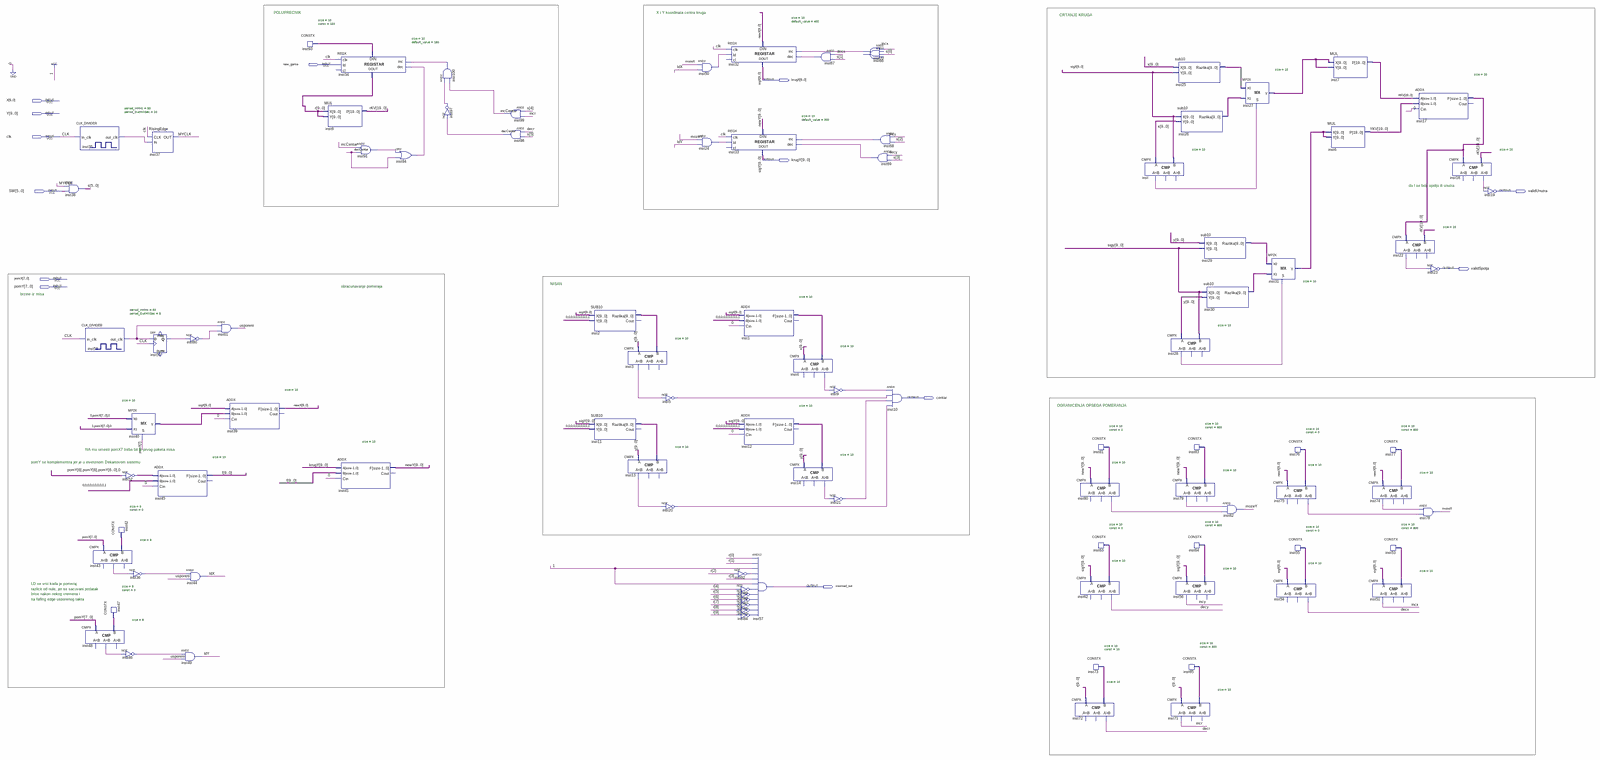
[diagram p0: schematic sheet, whole]
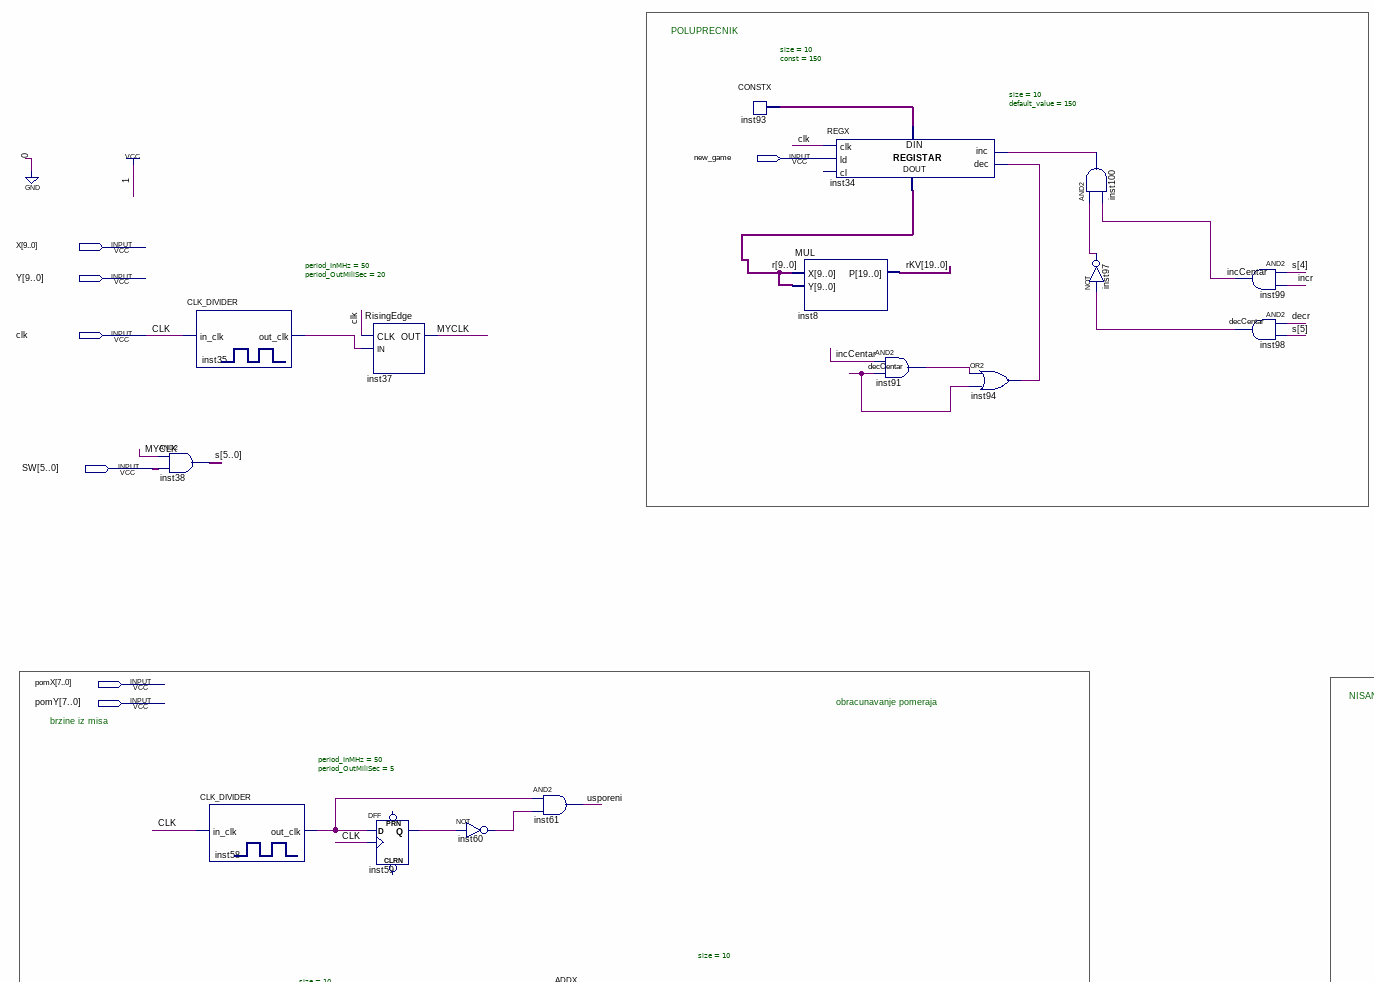
[diagram p1: schematic sheet, upper left part]
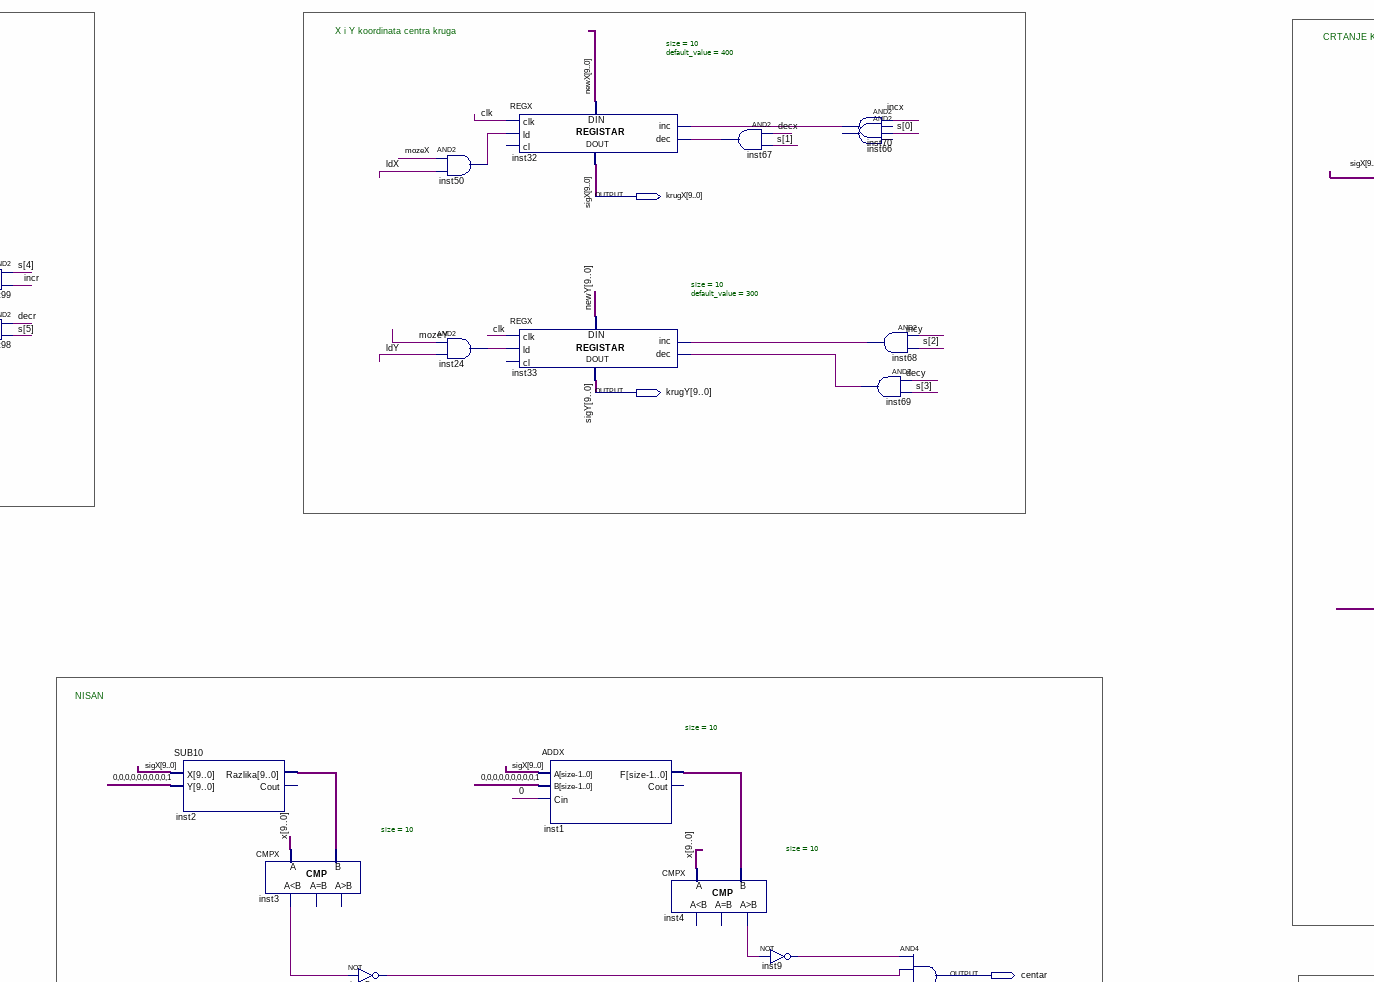
[diagram p2: schematic sheet, upper centre part]
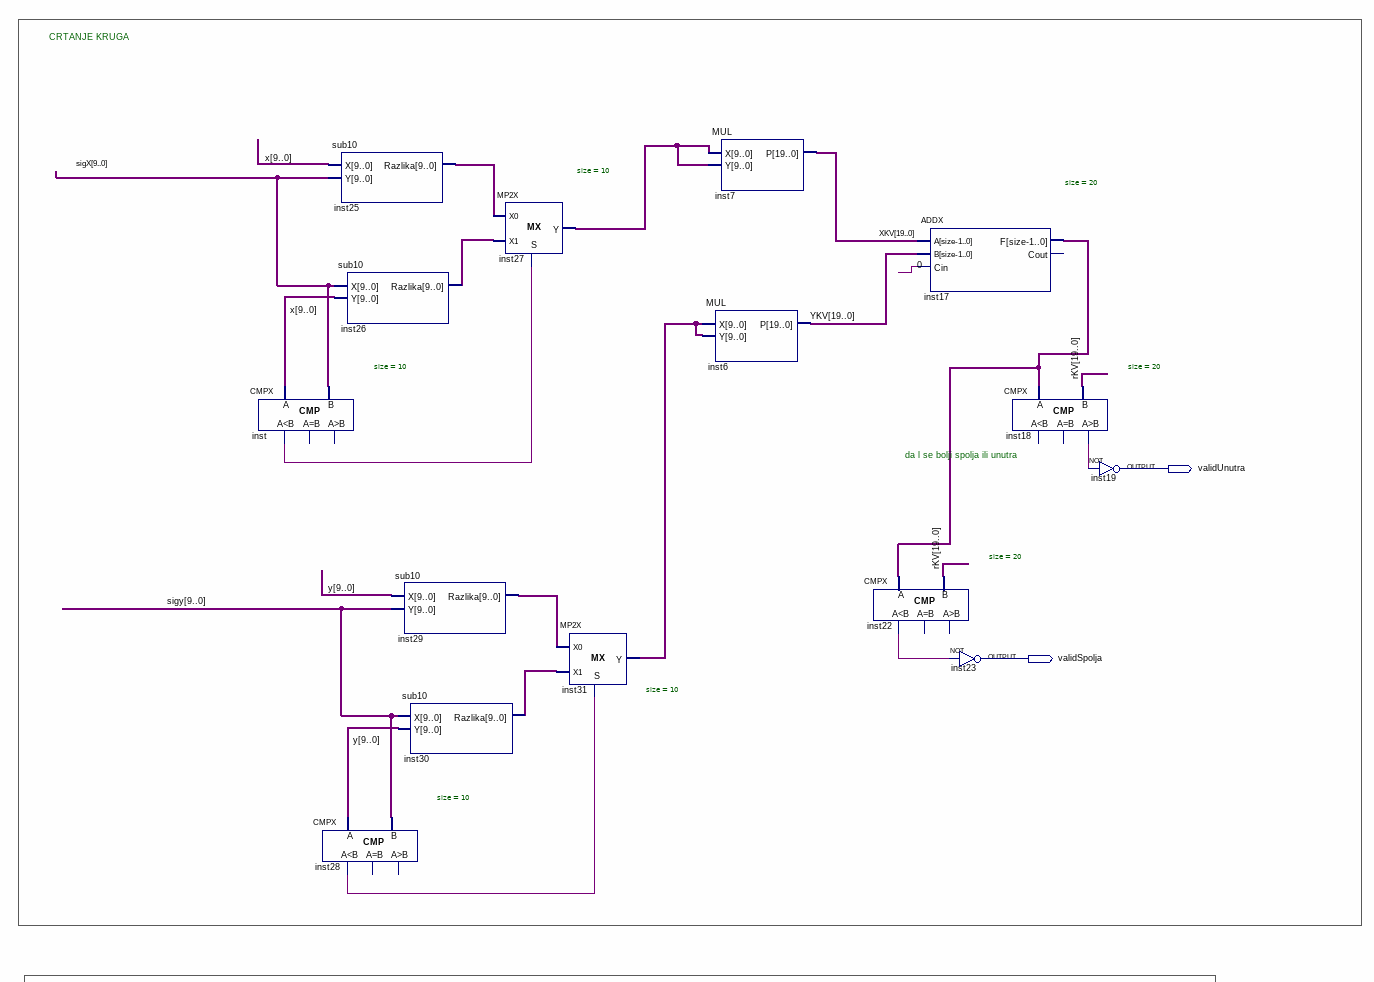
[diagram p3: schematic sheet, upper right part]
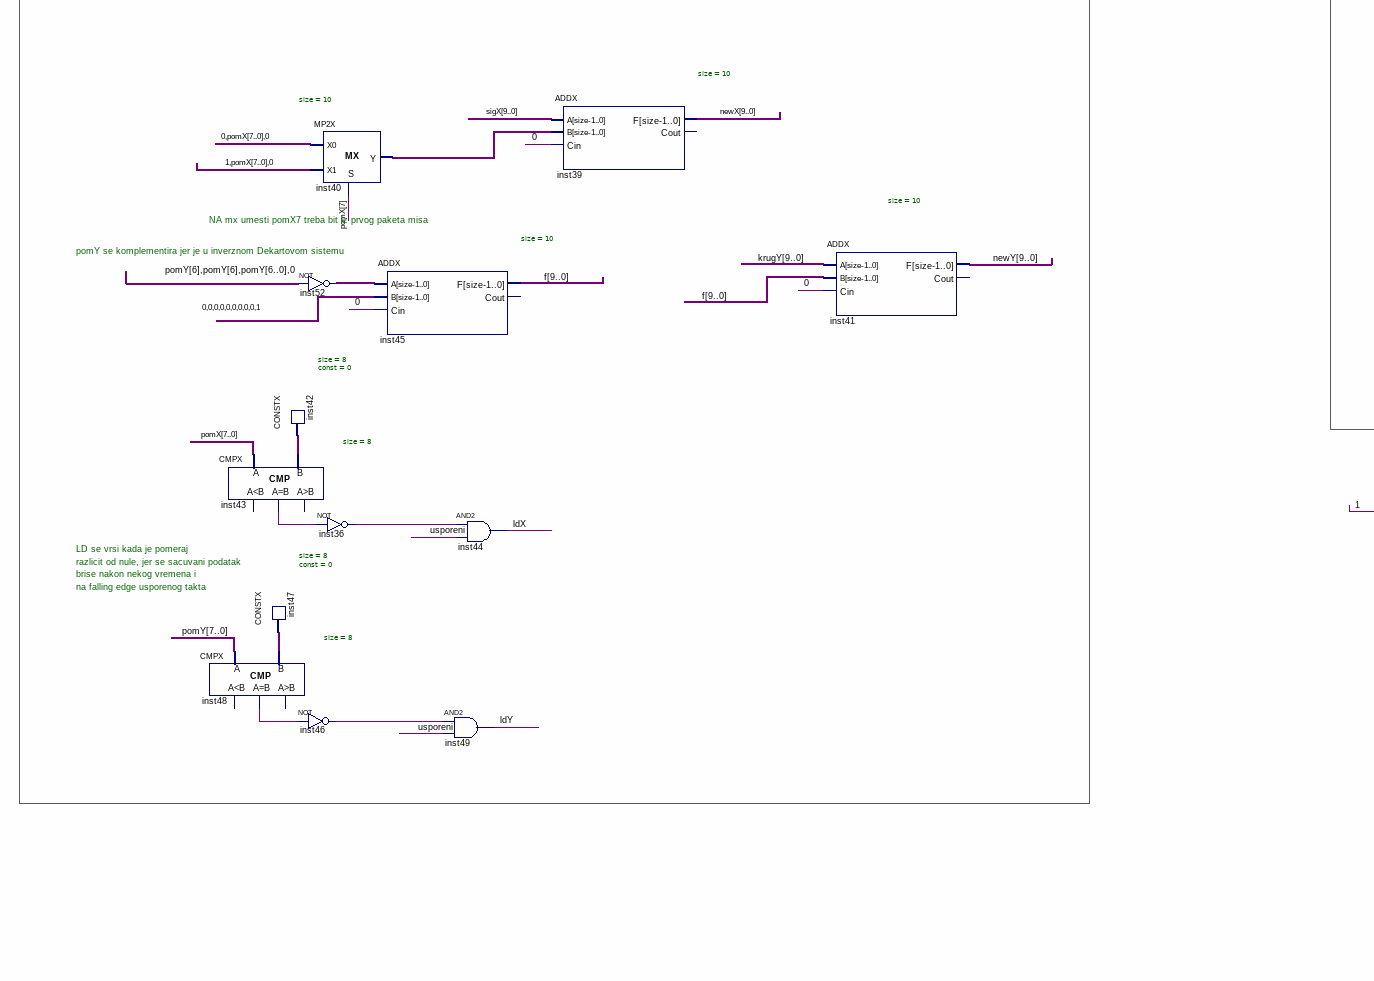
[diagram p4: schematic sheet, lower left part]
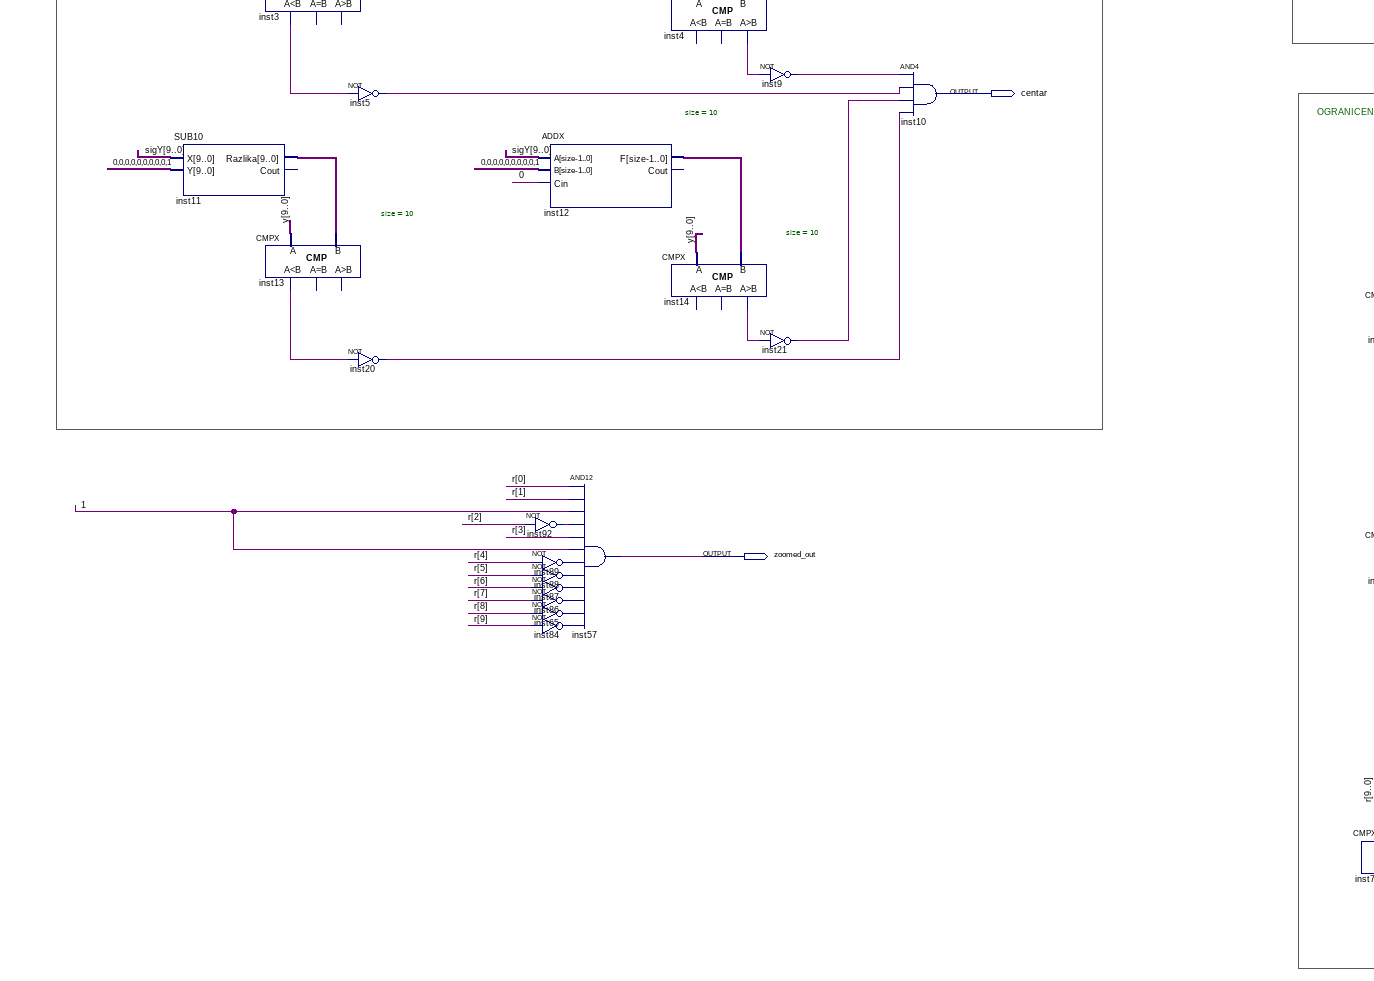
[diagram p5: schematic sheet, lower centre part]
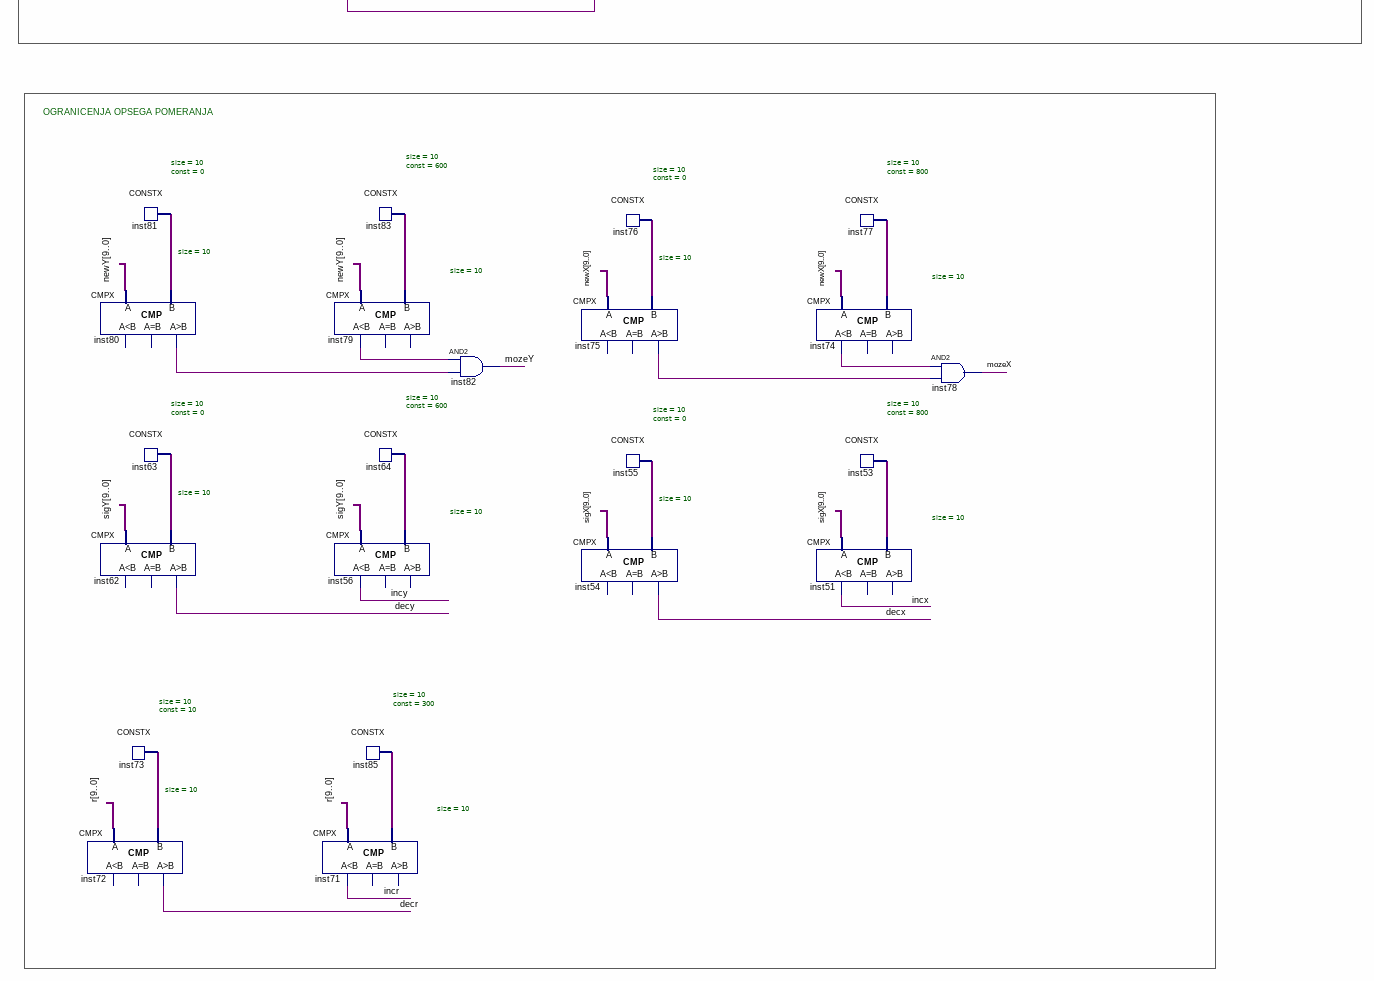
[diagram p6: schematic sheet, lower right part]
// Quartus schematic krug.bdf as structural Verilog: 96 symbols, 13 pins
module krug (
  input  new_game,
  input  [9:0] X,
  input  [9:0] Y,
  input  clk,
  input  [5:0] SW,
  input  [7:0] pomX,
  input  [7:0] pomY,
  output [9:0] krugX,
  output [9:0] krugY,
  output validUnutra,
  output validSpolja,
  output centar,
  output zoomed_out
);

  wire decCentar, decr, decx, decy, incCentar, incr, incx, incy, inst3_ls, inst4_gr, inst5_out, inst9_out,
       inst13_ls, inst14_gr, inst18_gr, inst20_out, inst21_out, inst22_ls, inst24_out, inst28_ls,
       inst35_out_clk, inst36_out, inst43_eq, inst46_out, inst48_eq, inst50_out, inst58_out_clk, inst59_q,
       inst60_out, inst65_out, inst67_out, inst68_out, inst69_out, inst70_out, inst74_ls, inst75_gr,
       inst79_ls, inst80_gr, inst84_out, inst86_out, inst87_out, inst88_out, inst89_out, inst91_out,
       inst92_out, inst94_out, inst97_out, inst100_out, inst_ls, ldX, ldY, mozeX, mozeY, MYCLK, usporeni;
  wire [5:0] s;
  wire [7:0] inst42_data, inst47_data;
  wire [9:0] f, inst1_f, inst2_razlika, inst11_razlika, inst12_f, inst25_razlika, inst26_razlika, inst27_y,
       inst29_razlika, inst30_razlika, inst31_y, inst40_y, inst52_out, inst53_data, inst55_data, inst63_data,
       inst64_data, inst73_data, inst76_data, inst77_data, inst81_data, inst83_data, inst85_data,
       inst93_data, newX, newY, r;
  wire [19:0] inst17_f, rKV, XKV, YKV;

  assign s = {6{MYCLK}} & SW;  // AND2 inst38, 6 bits wide
  CLK_DIVIDER #(.period_InMHz(50), .period_OutMiliSec(20)) inst35 (.in_clk(clk), .out_clk(inst35_out_clk));
  CLK_DIVIDER #(.period_InMHz(50), .period_OutMiliSec(5)) inst58 (.in_clk(clk), .out_clk(inst58_out_clk));
  CMPX #(.size(8)) inst48 (.A(pomY), .B(inst47_data), .eq(inst48_eq));  // open: ls, gr
  CMPX #(.size(8)) inst43 (.A(pomX), .B(inst42_data), .eq(inst43_eq));  // open: ls, gr
  CONSTX #(.size(8), .\const (0)) inst47 (.data(inst47_data));
  MP2X #(.size(10)) inst40 (.S(pomX[7]), .X0({1'b0, pomX, 1'b0}), .X1({1'b1, pomX, 1'b0}), .Y(inst40_y));
  assign inst52_out = ~{{3{pomY[6]}}, pomY[5:0], 1'b0};  // NOT inst52, 10 bits wide
  CONSTX #(.size(8), .\const (0)) inst42 (.data(inst42_data));
  not inst46 (inst46_out, inst48_eq);
  RisingEdge inst37 (.CLK(clk), .IN(inst35_out_clk), .OUT(MYCLK));
  not inst36 (inst36_out, inst43_eq);
  DFF inst59 (.CLK(clk), .D(inst58_out_clk), .Q(inst59_q));  // open: CLRN, PRN
  ADDX #(.size(10)) inst45 (.A(inst52_out), .B(10'b0000000001), .Cin(1'b0), .F(f));  // open: Cout
  not inst60 (inst60_out, inst59_q);
  and inst44 (ldX, inst36_out, usporeni);
  and inst49 (ldY, inst46_out, usporeni);
  and inst61 (usporeni, inst58_out_clk, inst60_out);
  ADDX #(.size(10)) inst39 (.A(krugX), .B(inst40_y), .Cin(1'b0), .F(newX));  // open: Cout
  CONSTX #(.size(10), .\const (150)) inst93 (.data(inst93_data));
  MUL inst8 (.X(r), .Y(r), .P(rKV));
  REGX #(.size(10), .default_value(150)) inst34 (
    .clk(clk), .ld(new_game), .inc(inst100_out), .dec(inst94_out), .data_in(inst93_data), .data_out(r));  // open: cl
  ADDX #(.size(10)) inst41 (.A(krugY), .B(f), .Cin(1'b0), .F(newY));  // open: Cout
  and inst91 (inst91_out, incCentar, decCentar);
  or inst94 (inst94_out, inst91_out, decCentar);
  and inst100 (inst100_out, inst97_out, incCentar);
  not inst97 (inst97_out, decCentar);
  and inst99 (incCentar, s[4], incr);
  and inst98 (decCentar, decr, s[5]);
  SUB10 inst2 (.X(krugX), .Y(10'b0000000001), .Razlika(inst2_razlika));  // open: Cout
  SUB10 inst11 (.X(krugY), .Y(10'b0000000001), .Razlika(inst11_razlika));  // open: Cout
  CMPX #(.size(10)) inst3 (.A(X), .B(inst2_razlika), .ls(inst3_ls));  // open: eq, gr
  CMPX #(.size(10)) inst13 (.A(Y), .B(inst11_razlika), .ls(inst13_ls));  // open: eq, gr
  not inst5 (inst5_out, inst3_ls);
  not inst20 (inst20_out, inst13_ls);
  and inst50 (inst50_out, mozeX, ldX);
  and inst24 (inst24_out, mozeY, ldY);
  REGX #(.size(10), .default_value(400)) inst32 (
    .clk(clk), .ld(inst50_out), .inc(inst70_out), .dec(inst67_out), .data_in(newX), .data_out(krugX));  // open: cl
  REGX #(.size(10), .default_value(300)) inst33 (
    .clk(clk), .ld(inst24_out), .inc(inst68_out), .dec(inst69_out), .data_in(newY), .data_out(krugY));  // open: cl
  ADDX #(.size(10)) inst1 (.A(krugX), .B(10'b0000000001), .Cin(1'b0), .F(inst1_f));  // open: Cout
  ADDX #(.size(10)) inst12 (.A(krugY), .B(10'b0000000001), .Cin(1'b0), .F(inst12_f));  // open: Cout
  not inst92 (inst92_out, r[2]);
  not inst89 (inst89_out, r[4]);
  not inst88 (inst88_out, r[5]);
  not inst87 (inst87_out, r[6]);
  not inst86 (inst86_out, r[7]);
  not inst65 (inst65_out, r[8]);
  not inst84 (inst84_out, r[9]);
  and inst57 (zoomed_out, r[0], r[1], 1'b1, inst92_out, r[3], 1'b1, inst89_out, inst88_out, inst87_out, inst86_out, inst65_out, inst84_out);
  CMPX #(.size(10)) inst4 (.A(X), .B(inst1_f), .gr(inst4_gr));  // open: ls, eq
  CMPX #(.size(10)) inst14 (.A(Y), .B(inst12_f), .gr(inst14_gr));  // open: ls, eq
  and inst67 (inst67_out, decx, s[1]);
  not inst9 (inst9_out, inst4_gr);
  not inst21 (inst21_out, inst14_gr);
  and inst70 (inst70_out, incx, s[0]);
  // AND2 inst66 is placed but not wired
  and inst69 (inst69_out, decy, s[3]);
  and inst68 (inst68_out, incy, s[2]);
  and inst10 (centar, inst9_out, inst5_out, inst21_out, inst20_out);
  CMPX #(.size(10)) inst80 (.A(newY), .B(inst81_data), .gr(inst80_gr));  // open: ls, eq
  CMPX #(.size(10)) inst62 (.A(krugY), .B(inst63_data), .gr(decy));  // open: ls, eq
  CMPX #(.size(10)) inst72 (.A(r), .B(inst73_data), .gr(decr));  // open: ls, eq
  CONSTX #(.size(10), .\const (0)) inst81 (.data(inst81_data));
  CONSTX #(.size(10), .\const (0)) inst63 (.data(inst63_data));
  CONSTX #(.size(10), .\const (10)) inst73 (.data(inst73_data));
  CMPX #(.size(10)) inst (.A(X), .B(krugX), .ls(inst_ls));  // open: eq, gr
  sub10 inst25 (.X(X), .Y(krugX), .Razlika(inst25_razlika));
  sub10 inst26 (.X(krugX), .Y(X), .Razlika(inst26_razlika));
  CMPX #(.size(10)) inst28 (.A(Y), .B(krugY), .ls(inst28_ls));  // open: eq, gr
  CMPX #(.size(10)) inst79 (.A(newY), .B(inst83_data), .ls(inst79_ls));  // open: eq, gr
  CMPX #(.size(10)) inst56 (.A(krugY), .B(inst64_data), .ls(incy));  // open: eq, gr
  CONSTX #(.size(10), .\const (300)) inst85 (.data(inst85_data));
  CMPX #(.size(10)) inst71 (.A(r), .B(inst85_data), .ls(incr));  // open: eq, gr
  sub10 inst29 (.X(Y), .Y(krugY), .Razlika(inst29_razlika));
  sub10 inst30 (.X(krugY), .Y(Y), .Razlika(inst30_razlika));
  CONSTX #(.size(10), .\const (600)) inst83 (.data(inst83_data));
  CONSTX #(.size(10), .\const (600)) inst64 (.data(inst64_data));
  and inst82 (mozeY, inst79_ls, inst80_gr);
  MP2X #(.size(10)) inst27 (.S(inst_ls), .X0(inst25_razlika), .X1(inst26_razlika), .Y(inst27_y));
  MP2X #(.size(10)) inst31 (.S(inst28_ls), .X0(inst29_razlika), .X1(inst30_razlika), .Y(inst31_y));
  CMPX #(.size(10)) inst75 (.A(newX), .B(inst76_data), .gr(inst75_gr));  // open: ls, eq
  CMPX #(.size(10)) inst54 (.A(krugX), .B(inst55_data), .gr(decx));  // open: ls, eq
  CONSTX #(.size(10), .\const (0)) inst76 (.data(inst76_data));
  CONSTX #(.size(10), .\const (0)) inst55 (.data(inst55_data));
  MUL inst6 (.X(inst31_y), .Y(inst31_y), .P(YKV));
  MUL inst7 (.X(inst27_y), .Y(inst27_y), .P(XKV));
  CMPX #(.size(10)) inst74 (.A(newX), .B(inst77_data), .ls(inst74_ls));  // open: eq, gr
  CMPX #(.size(10)) inst51 (.A(krugX), .B(inst53_data), .ls(incx));  // open: eq, gr
  CONSTX #(.size(10), .\const (800)) inst77 (.data(inst77_data));
  CONSTX #(.size(10), .\const (800)) inst53 (.data(inst53_data));
  CMPX #(.size(20)) inst22 (.A(inst17_f), .B(rKV), .ls(inst22_ls));  // open: eq, gr
  ADDX #(.size(20)) inst17 (.A(XKV), .B(YKV), .Cin(1'b0), .F(inst17_f));  // open: Cout
  not inst23 (validSpolja, inst22_ls);
  and inst78 (mozeX, inst74_ls, inst75_gr);
  CMPX #(.size(20)) inst18 (.A(inst17_f), .B(rKV), .gr(inst18_gr));  // open: ls, eq
  not inst19 (validUnutra, inst18_gr);

  // Other names for the same wires on the sheet: sigX[9:0] = krugX; sigY[9:0] = krugY

  // Notes on the sheet:
  //   POLUPRECNIK                    
  //   X i Y koordinata centra kruga             
  //   CRTANJE KRUGA            
  //   da l se bolji spolja ili unutra
  //   NISAN          
  //   obracunavanje pomeraja    
  //   brzine iz misa
  //   OGRANICENJA OPSEGA POMERANJA             
  //   NA mx umesti pomX7 treba bit iz prvog paketa misa
  //   pomY se komplementira jer je u inverznom Dekartovom sistemu
  //   LD se vrsi kada je pomeraj 
  //   razlicit od nule, jer se sacuvani podatak 
  //   brise nakon nekog vremena i
  //   na falling edge usporenog takta
endmodule
